# EAGLE schematic RadTherm (EAGLE 7.1.0)
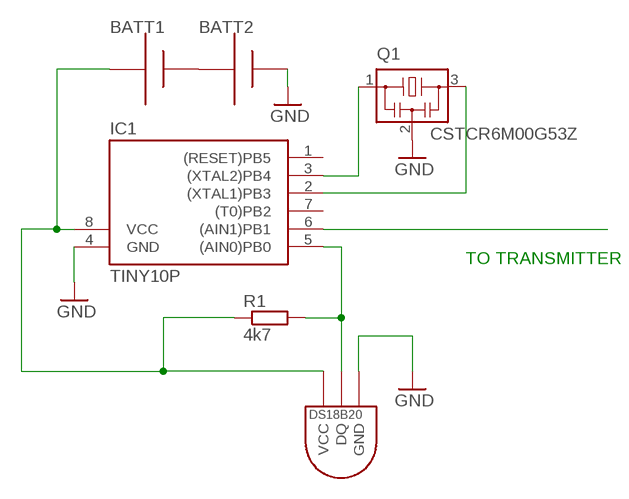
[diagram p0: schematic, sheet 1]

## Parts
BATT1  AAA  [12BH412]
BATT2  AAA  [12BH412]
IC1  TINY10P  [DIL08]
Q1  CSTCR6M00G53Z  [CSTCR6M]
R1  4k7  R-EU_0204/7  [0204/7]
U$1  DS1820TO92  [DS1820]

## Nets
GND: BATT2.+ IC1.4(GND) Q1.2 U$1.GND
N$1: BATT1.+ BATT2.-
N$2: IC1.3((XTAL2)PB4) Q1.1
N$3: IC1.2((XTAL1)PB3) Q1.3
N$5: IC1.5((AIN0)PB0) R1.2 U$1.DQ
N$6: IC1.6((AIN1)PB1)
N$7: BATT1.- IC1.8(VCC) R1.1 U$1.VDD(VCC)
Unconnected: IC1.1((RESET)PB5) IC1.7((T0)PB2)

## Notes on the sheet
- TO TRANSMITTER

## Library data of the parts
BATT1 BATT2 = adafruit:AAA: AAA PC pin holder Mouser part #12BH412 - but pretty much any 1x AAA battery holder should be the same http://www.ladyada.net/library/pcb/eaglelibrary.html
IC1 = atmel:TINY10: MICROCONTROLLER 1 Kbytes ROM; OC_FARNELL: unknown; OC_NEWARK: unknown
Q1 = murata-filter:CSTCR: Resonator Source: murata.co.jp; MPN: CSTCR6M00G53-R0; OC_FARNELL: 1170434; OC_NEWARK: 25M8759
R1 = rcl:R-EU_: RESISTOR, European symbol
U$1 = Ava:DS1820: DS18B20 Programmable Resolution 1-Wire Digital Thermometer Description The DS18B20 digital thermometer provides 9-bit to 12-bit Celsius temperature measurements and has an alarm function with nonvolatile user-programmable upper and lower trigger points. The DS18B20 communicates over a 1-Wire® bus that by definition requires only one data line (and ground) for communication with a central microprocessor. It has an operating temperature range of -55°C to +125°C and is accurate to ±0.5°C over the range of -10°C to +85°C. In addition, the DS18B20 can derive power directly from the data line ("parasite power"), eliminating the need for an external power supply. Each DS18B20 has a unique 64-bit serial code, which allows multiple DS18B20s to function on the same 1-Wire bus. Thus, it is simple to use one microprocessor to control many DS18B20s distributed over a large area. Applications that can benefit from this feature include HVAC environmental controls, temperature monitoring systems inside buildings, equipment, or machinery, and process monitoring and control systems.